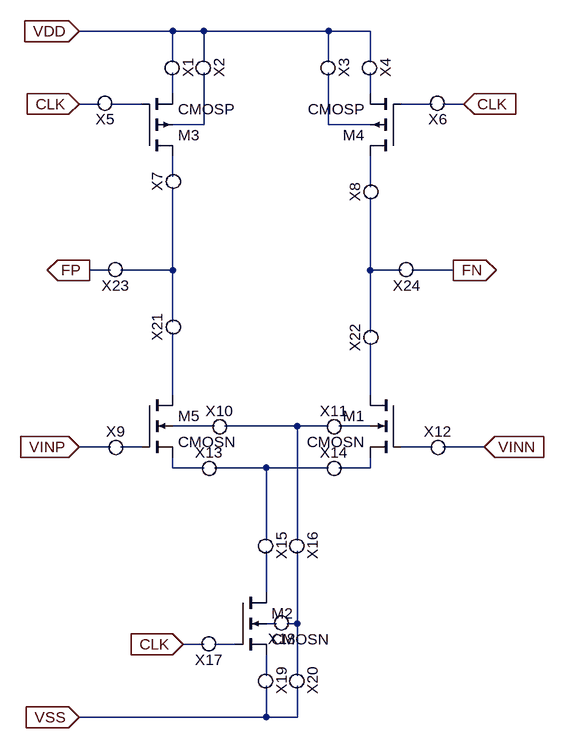
[diagram p0: schematic module1.asc]
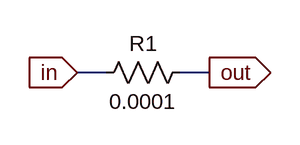
[diagram p1: sub-circuit para_register.asc]
module1.asc, the LTspice schematic file:
Version 4
SHEET 1 1176 900
WIRE 384 -224 240 -224
WIRE 432 -224 384 -224
WIRE 624 -224 432 -224
WIRE 688 -224 624 -224
WIRE 384 -176 384 -224
WIRE 432 -176 432 -224
WIRE 624 -176 624 -224
WIRE 688 -176 688 -224
WIRE 384 -128 384 -160
WIRE 688 -128 688 -160
WIRE 272 -112 240 -112
WIRE 336 -112 288 -112
WIRE 784 -112 736 -112
WIRE 832 -112 800 -112
WIRE 432 -80 432 -160
WIRE 432 -80 384 -80
WIRE 624 -80 624 -160
WIRE 688 -80 624 -80
WIRE 384 0 384 -32
WIRE 688 16 688 -32
WIRE 288 144 256 144
WIRE 384 144 384 16
WIRE 384 144 304 144
WIRE 688 144 688 32
WIRE 736 144 688 144
WIRE 816 144 752 144
WIRE 384 224 384 144
WIRE 688 240 688 144
WIRE 384 336 384 240
WIRE 688 336 688 256
WIRE 448 384 384 384
WIRE 576 384 464 384
WIRE 624 384 576 384
WIRE 688 384 640 384
WIRE 288 416 240 416
WIRE 336 416 304 416
WIRE 784 416 736 416
WIRE 864 416 800 416
WIRE 384 448 384 432
WIRE 432 448 384 448
WIRE 528 448 448 448
WIRE 624 448 528 448
WIRE 688 448 688 432
WIRE 688 448 640 448
WIRE 528 560 528 448
WIRE 576 560 576 384
WIRE 528 640 528 576
WIRE 544 688 528 688
WIRE 576 688 576 576
WIRE 576 688 560 688
WIRE 432 720 400 720
WIRE 480 720 448 720
WIRE 528 768 528 736
WIRE 576 768 576 688
WIRE 528 832 528 784
WIRE 528 832 240 832
WIRE 576 832 576 784
WIRE 576 832 528 832
FLAG 240 -224 VDD
IOPIN 240 -224 In
FLAG 240 -112 CLK
IOPIN 240 -112 In
FLAG 240 416 VINP
IOPIN 240 416 In
FLAG 240 832 VSS
IOPIN 240 832 In
FLAG 864 416 VINN
IOPIN 864 416 In
FLAG 400 720 CLK
IOPIN 400 720 In
FLAG 832 -112 CLK
IOPIN 832 -112 In
FLAG 256 144 FP
IOPIN 256 144 Out
FLAG 816 144 FN
IOPIN 816 144 Out
SYMBOL nmos4 736 336 M0
SYMATTR InstName M1
SYMATTR Value CMOSN
SYMATTR Value2 l={L2} w={W2} m={M2}
SYMBOL nmos4 480 640 R0
SYMATTR InstName M2
SYMATTR Value CMOSN
SYMATTR Value2 l={L3} w={W3} m={M3}
SYMBOL pmos4 336 -32 M180
SYMATTR InstName M3
SYMATTR Value CMOSP
SYMATTR Value2 l={L4} w={W4} m={M4}
SYMBOL pmos4 736 -32 R180
SYMATTR InstName M4
SYMATTR Value CMOSP
SYMATTR Value2 l={L5} w={W5} m={M5}
SYMBOL nmos4 336 336 R0
SYMATTR InstName M5
SYMATTR Value CMOSN
SYMATTR Value2 l={L1} w={W1} m={M1}
SYMBOL para_register 368 -176 R90
SYMATTR InstName X1
SYMBOL para_register 416 -176 R90
SYMATTR InstName X2
SYMBOL para_register 608 -176 R90
SYMATTR InstName X3
SYMBOL para_register 672 -176 R90
SYMATTR InstName X4
SYMBOL para_register 288 -128 R180
SYMATTR InstName X5
SYMBOL para_register 800 -128 R180
SYMATTR InstName X6
SYMBOL para_register 400 16 R270
SYMATTR InstName X7
SYMBOL para_register 704 32 R270
SYMATTR InstName X8
SYMBOL para_register 288 432 R0
SYMATTR InstName X9
SYMBOL para_register 448 400 R0
SYMATTR InstName X10
SYMBOL para_register 624 400 R0
SYMATTR InstName X11
SYMBOL para_register 784 432 R0
SYMATTR InstName X12
SYMBOL para_register 432 464 R0
SYMATTR InstName X13
SYMBOL para_register 624 464 R0
SYMATTR InstName X14
SYMBOL para_register 512 560 R90
SYMATTR InstName X15
SYMBOL para_register 560 560 R90
SYMATTR InstName X16
SYMBOL para_register 448 704 R180
SYMATTR InstName X17
SYMBOL para_register 560 672 R180
SYMATTR InstName X18
SYMBOL para_register 512 768 R90
SYMATTR InstName X19
SYMBOL para_register 560 768 R90
SYMATTR InstName X20
SYMBOL para_register 400 240 R270
SYMATTR InstName X21
SYMBOL para_register 704 256 R270
SYMATTR InstName X22
SYMBOL para_register 304 128 R180
SYMATTR InstName X23
SYMBOL para_register 752 128 R180
SYMATTR InstName X24

para_register.asc, the sub-circuit schematic file:
Version 4
SHEET 1 880 680
WIRE 160 -176 128 -176
WIRE 272 -176 240 -176
FLAG 128 -176 in
IOPIN 128 -176 In
FLAG 272 -176 out
IOPIN 272 -176 Out
SYMBOL res 256 -192 R90
WINDOW 0 0 56 VBottom 2
WINDOW 3 32 56 VTop 2
SYMATTR InstName R1
SYMATTR Value 0.0001

The netlist it stands for:
* module1.asc
M1 N012 N017 N020 N015 CMOSN l={L2} w={W2} m={M2}
M2 N021 N024 N025 N022 CMOSN l={L3} w={W3} m={M3}
M3 N007 N003 N001 N005 CMOSP l={L4} w={W4} m={M4}
M4 N008 N004 N002 N006 CMOSP l={L5} w={W5} m={M5}
M5 N011 N016 N018 N013 CMOSN l={L1} w={W1} m={M1}
XX1 VDD N001 para_register
XX2 VDD N005 para_register
XX3 VDD N006 para_register
XX4 VDD N002 para_register
XX5 N003 CLK para_register
XX6 CLK N004 para_register
XX7 N009 N007 para_register
XX8 N010 N008 para_register
XX9 VINP N016 para_register
XX10 N013 N014 para_register
XX11 N014 N015 para_register
XX12 N017 VINN para_register
XX13 N018 N019 para_register
XX14 N019 N020 para_register
XX15 N019 N021 para_register
XX16 N014 N023 para_register
XX17 N024 CLK para_register
XX18 N023 N022 para_register
XX19 N025 VSS para_register
XX20 N023 VSS para_register
XX21 N011 N009 para_register
XX22 N012 N010 para_register
XX23 N009 FP para_register
XX24 FN N010 para_register

* block symbol definitions
.subckt para_register in out
R1 out in 0.0001
.ends para_register

.model NMOS NMOS
.model PMOS PMOS
.lib standard.mos
.backanno
.end